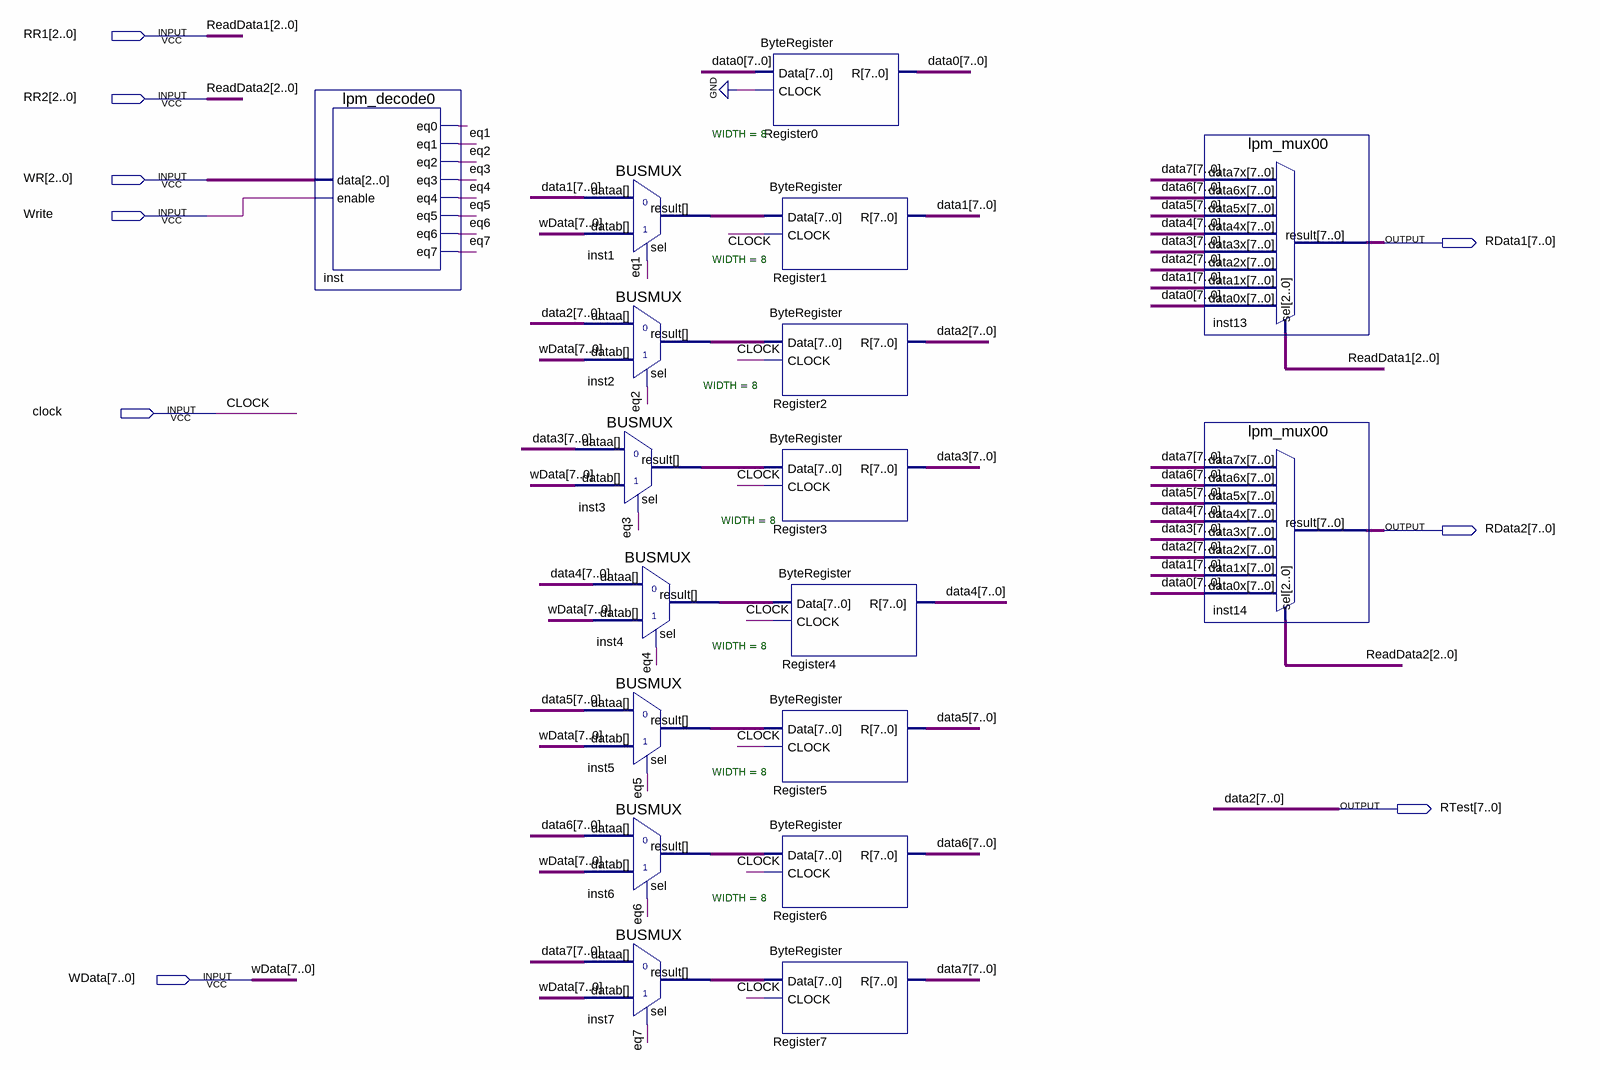
[diagram p0: schematic sheet]
// Quartus schematic registerFile.bdf as structural Verilog: 18 symbols, 9 pins
module registerFile (
  input  [2:0] RR1,
  input  [2:0] RR2,
  input  [2:0] WR,
  input  Write,
  input  clock,
  input  [7:0] WData,
  output [7:0] RData1,
  output [7:0] RData2,
  output [7:0] RTest
);

  wire eq1, eq2, eq3, eq4, eq5, eq6, eq7, inst_eq0;
  wire [7:0] data0, data1, data3, data4, data5, data6, data7, inst1_result, inst2_result, inst3_result,
       inst4_result, inst5_result, inst6_result, inst7_result;

  lpm_decode0 inst (
    .data(WR), .enable(Write), .eq0(inst_eq0), .eq1(eq1), .eq2(eq2), .eq3(eq3), .eq4(eq4), .eq5(eq5),
    .eq6(eq6), .eq7(eq7));
  BUSMUX #(.WIDTH(8)) inst1 (.datab(WData), .sel(eq1), .dataa(data1), .result(inst1_result));
  BUSMUX #(.WIDTH(8)) inst2 (.datab(WData), .sel(eq2), .dataa(RTest), .result(inst2_result));
  BUSMUX #(.WIDTH(8)) inst3 (.datab(WData), .sel(eq3), .dataa(data3), .result(inst3_result));
  BUSMUX #(.WIDTH(8)) inst4 (.datab(WData), .sel(eq4), .dataa(data4), .result(inst4_result));
  BUSMUX #(.WIDTH(8)) inst5 (.datab(WData), .sel(eq5), .dataa(data5), .result(inst5_result));
  BUSMUX #(.WIDTH(8)) inst6 (.datab(WData), .sel(eq6), .dataa(data6), .result(inst6_result));
  BUSMUX #(.WIDTH(8)) inst7 (.datab(WData), .sel(eq7), .dataa(data7), .result(inst7_result));
  ByteRegister Register0 (.Data(data0), .CLOCK(1'b0), .R(data0));
  ByteRegister Register1 (.Data(inst1_result), .CLOCK(clock), .R(data1));
  ByteRegister Register2 (.Data(inst2_result), .CLOCK(clock), .R(RTest));
  ByteRegister Register3 (.Data(inst3_result), .CLOCK(clock), .R(data3));
  ByteRegister Register4 (.Data(inst4_result), .CLOCK(clock), .R(data4));
  ByteRegister Register5 (.Data(inst5_result), .CLOCK(clock), .R(data5));
  ByteRegister Register6 (.Data(inst6_result), .CLOCK(clock), .R(data6));
  ByteRegister Register7 (.Data(inst7_result), .CLOCK(clock), .R(data7));
  lpm_mux00 inst13 (
    .data7x(data7), .data6x(data6), .data5x(data5), .data4x(data4), .data3x(data3), .data2x(RTest),
    .data1x(data1), .data0x(data0), .sel(RR1), .result(RData1));
  lpm_mux00 inst14 (
    .data7x(data7), .data6x(data6), .data5x(data5), .data4x(data4), .data3x(data3), .data2x(RTest),
    .data1x(data1), .data0x(data0), .sel(RR2), .result(RData2));

  // Other names for the same wires on the sheet: data2[7:0] = RTest; ReadData1[2:0] = RR1; ReadData2[2:0] = RR2
endmodule
